# Altium schematic sheet Sheet_1_2021-12-20.schdoc
size 49 x 27 mm
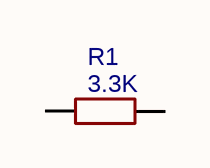
[diagram p0: Sheet_1_2021-12-20.schdoc]

## Parts
R1  3.3K  [R0603_NEW]

## Nets

Not connected (* = marked no-connect by the designer): R1 1 2

## Library data of the parts
R1 = 3.3K: BOM_Manufacturer: UniOhm; BOM_Manufacturer Part: 0603WAF3301T5E; nameAlias: Resistance (Ohms); BOM_Supplier: LCSC; BOM_Supplier Part: C22978; BOM_JLCPCB Part Class: Basic Part; spicePre: R; spiceSymbolName: 0603WAF3301T5E